# Altium schematic sheet DevKit Board.SchDoc
size B
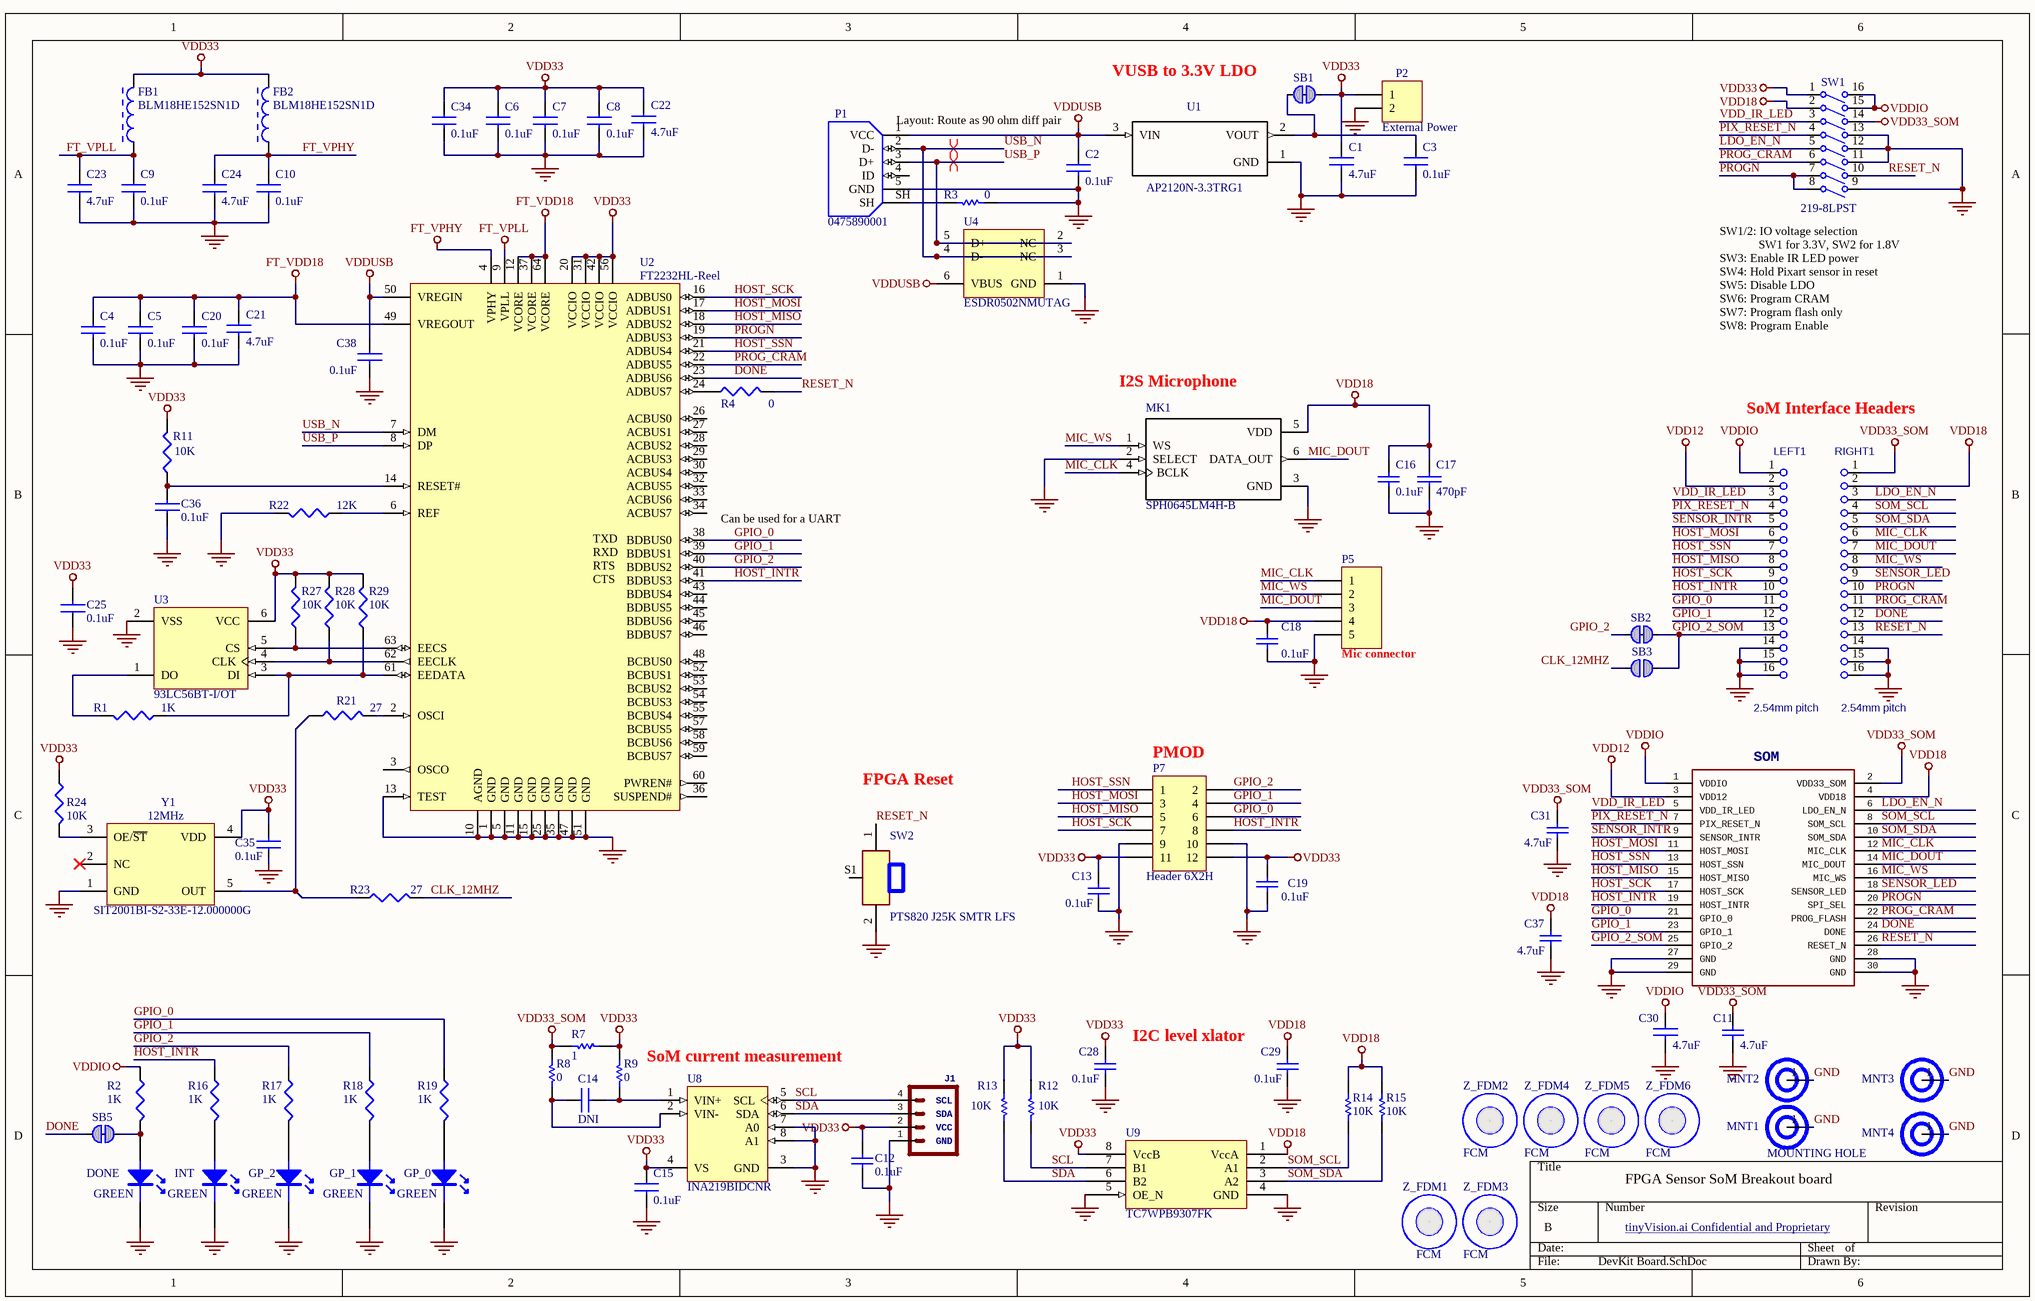
[diagram p0: DevKit Board.SchDoc]

## Parts
C1  4.7uF  [CAPC1005X60N]
C2  0.1uF  [CAPC1005X60N]
C3  0.1uF  [CAPC1005X60N]
C4  0.1uF  [CAPC1005X60N]
C5  0.1uF  [CAPC1005X60N]
C6  0.1uF  [CAPC1005X60N]
C7  0.1uF  [CAPC1005X60N]
C8  0.1uF  [CAPC1005X60N]
C9  0.1uF  [CAPC1005X60N]
C10  0.1uF  [CAPC1005X60N]
C11  4.7uF  [CAPC1005X60N]
C12  0.1uF  [CAPC1005X60N]
C13  0.1uF  [CAPC1005X60N]
C14  DNI  [CAPC1005X60N]
C15  0.1uF  [CAPC1005X60N]
C16  0.1uF  [CAPC1005X60N]
C17  470pF  [CAPC1005X60N]
C18  0.1uF  [CAPC1005X60N]
C19  0.1uF  [CAPC1005X60N]
C20  0.1uF  [CAPC1005X60N]
C21  4.7uF  [CAPC1005X60N]
C22  4.7uF  [CAPC1005X60N]
C23  4.7uF  [CAPC1005X60N]
C24  4.7uF  [CAPC1005X60N]
C25  0.1uF  [CAPC1005X60N]
C28  0.1uF  [CAPC1005X60N]
C29  0.1uF  [CAPC1005X60N]
C30  4.7uF  [CAPC1005X60N]
C31  4.7uF  [CAPC1005X60N]
C34  0.1uF  [CAPC1005X60N]
C35  0.1uF  [CAPC1005X60N]
C36  0.1uF  [CAPC1005X60N]
C37  4.7uF  [CAPC1005X60N]
C38  0.1uF  [CAPC1005X60N]
DONE  GREEN  [LED2012N]
FB1  BLM18HE152SN1D  [MURA-BLM18-RF-H4-CHIP-2_V]
FB2  BLM18HE152SN1D  [MURA-BLM18-RF-H4-CHIP-2_V]
GP_0  GREEN  [LED2012N]
GP_1  GREEN  [LED2012N]
GP_2  GREEN  [LED2012N]
INT  GREEN  [LED2012N]
J1  (no value)  [1X04_1MM_RA]
LEFT1  value 2.54mm pitch  [HDR2x8]  (hidden comment: CONN_GENERIC_16)
MK1  SPH0645LM4H-B  [Knowles_SPH0645LM4H-B_0]
MNT1  MOUNTING HOLE  [MNT620-275N]
MNT2  MOUNTING HOLE  [MNT620-275N]  (value not drawn)
MNT3  MOUNTING HOLE  [MNT620-275N]  (value not drawn)
MNT4  MOUNTING HOLE  [MNT620-275N]  (value not drawn)
P1  0475890001  [*MOLEX_0475890001]
P2  External Power  [HDR1X2]
P5  Mic connector  [HDR1X5]
P7  Header 6X2H  [HDR2X6H]
R1  1K  [RESC1005X40N]
R2  1K  [RESC1005X40N]
R3  0  [RESC1005X40N]
R4  0  [RESC1005X40N]
R7  1  [RESC1005X40N]
R8  0  [RESC1005X40N]
R9  0  [RESC1005X40N]
R11  10K  [RESC1005X40N]
R12  10K  [RESC1005X40N]
R13  10K  [RESC1005X40N]
R14  10K  [RESC1005X40N]
R15  10K  [RESC1005X40N]
R16  1K  [RESC1005X40N]
R17  1K  [RESC1005X40N]
R18  1K  [RESC1005X40N]
R19  1K  [RESC1005X40N]
R21  27  [RESC1005X40N]
R22  12K  [RESC1005X40N]
R23  27  [RESC1005X40N]
R24  10K  [RESC1005X40N]
R27  10K  [RESC1005X40N]
R28  10K  [RESC1005X40N]
R29  10K  [RESC1005X40N]
RIGHT1  value 2.54mm pitch  [HDR2x8]  (hidden comment: CONN_GENERIC_16)
SB1  Solderbridge  [Solderbridge_Shorted]  (value not drawn)  (net tie, no BOM)
SB2  Solderbridge  [Solderbridge_Shorted]  (value not drawn)  (net tie, no BOM)
SB3  Solderbridge  [Solderbridge]  (value not drawn)  (no BOM)
SB5  Solderbridge  [Solderbridge_Shorted]  (value not drawn)  (net tie, no BOM)
SOM  Module  [SOM-SMD]  (value not drawn)
SW1  219-8LPST  [CTS-219-8LPST_V]
SW2  PTS820 J25K SMTR LFS  [PTS820J25MSMTRLFS]
U1  AP2120N-3.3TRG1  [*SOT91P240X110-3N]
U2  FT2232HL-Reel  [LQFP-64]
U3  93LC56BT-I/OT  [SOT-23-OT6_L]
U4  ESDR0502NMUTAG  [ONSC-UDFN-6-517AA-01_V]
U8  INA219BIDCNR  [DCN0008A_M]
U9  TC7WPB9307FK  [SSOP8-P-0.50A]
Y1  12MHz  MPN: SIT2001BI-S2-33E-12.000000G  [SOT23-5]
Z_FDM1  FCM  [FID100X250N]
Z_FDM2  FCM  [FID100X250N]
Z_FDM3  FCM  [FID100X250N]
Z_FDM4  FCM  [FID100X250N]
Z_FDM5  FCM  [FID100X250N]
Z_FDM6  FCM  [FID100X250N]

## Nets
FT_VDD18: C4.1 C5.1 C20.1 C21.1 U2.12(VCORE) U2.37(VCORE) U2.49(VREGOUT) U2.64(VCORE)
FT_VPHY: C10.1 C24.1 FB2.1 U2.4(VPHY)
FT_VPLL: C9.1 C23.1 FB1.1 U2.9(VPLL)
GND: C1.2 C2.2 C3.2 C4.2 C5.2 C6.2 C7.2 C8.2 C9.2 C10.2 C11.2 C12.2 C13.2 C15.2 C16.2 C17.2 C18.2 C19.2 C20.2 C21.2 C22.2 C23.2 C24.2 C25.1 C28.2 C29.2 C30.2 C31.2 C34.2 C35.1 C36.1 C37.2 C38.2 DONE.2 GP_0.2 GP_1.2 GP_2.2 INT.2 J1.1 LEFT1.14 LEFT1.15 LEFT1.16 MK1.2(SELECT) MK1.3(GND) MNT1.1(GND) MNT2.1(GND) MNT3.1(GND) MNT4.1(GND) P1.5(GND) P2.2 P5.5 P7.9 P7.10 R3.1 R22.1 RIGHT1.14 RIGHT1.15 RIGHT1.16 SOM.27(GND) SOM.28(GND) SOM.29(GND) SOM.30(GND) SW1.9(B8) SW1.11(B6) SW1.12(B5) SW1.13(B4) SW2.2 U1.1(GND) U2.1(GND) U2.5(GND) U2.10(AGND) U2.11(GND) U2.13(TEST) U2.15(GND) U2.25(GND) U2.35(GND) U2.47(GND) U2.51(GND) U3.2(VSS) U4.1(GND) U8.3(GND) U8.7(A0) U8.8(A1) U9.4(GND) U9.5(OE_N) Y1.1(GND)
VDD12: LEFT1.2 SOM.3(VDD12)
VDD18: C16.1 C17.1 C18.1 C29.1 C37.1 MK1.5(VDD) P5.4 R14.2 R15.2 RIGHT1.2 SOM.4(VDD18) SW1.2(A2) U9.1(VccA)
VDD33: C1.1 C6.1 C7.1 C8.1 C12.1 C13.1 C15.1 C19.1 C22.1 C25.2 C28.1 C34.1 C35.2 FB1.2 FB2.2 J1.2 P2.1 P7.11 P7.12 R7.1 R9.1 R11.1 R12.2 R13.2 R24.1 R27.1 R28.1 R29.1 SB1.1 SW1.1(A1) U2.20(VCCIO) U2.31(VCCIO) U2.42(VCCIO) U2.56(VCCIO) U3.6(VCC) U8.4(VS) U9.8(VccB) Y1.4(VDD)
VDD33_SOM: C11.1 C31.1 R7.2 R8.1 RIGHT1.1 SOM.2(VDD33_SOM) SW1.14(B3)
VDDIO: C30.1 LEFT1.1 R2.1 SOM.1(VDDIO) SW1.15(B2) SW1.16(B1)
VDDUSB: C2.1 C38.1 P1.1(VCC) U1.3(VIN) U2.50(VREGIN) U4.6(VBUS)
CLK_12MHZ: R23.2 SB3.2
DONE: RIGHT1.12 SB5.2 SOM.24(DONE) U2.23(ADBUS6)
GPIO_0: LEFT1.11 P7.6 R19.1 SOM.21(GPIO_0) U2.38(BDBUS0)
GPIO_1: LEFT1.12 P7.4 R18.1 SOM.23(GPIO_1) U2.39(BDBUS1)
GPIO_2: P7.2 R17.1 SB2.2 U2.40(BDBUS2)
GPIO_2_SOM: LEFT1.13 SB2.1 SB3.1 SOM.25(GPIO_2)
HOST_INTR: LEFT1.10 P7.8 R16.1 SOM.19(HOST_INTR) U2.41(BDBUS3)
HOST_MISO: LEFT1.8 P7.5 SOM.15(HOST_MISO) U2.18(ADBUS2)
HOST_MOSI: LEFT1.6 P7.3 SOM.11(HOST_MOSI) U2.17(ADBUS1)
HOST_SCK: LEFT1.9 P7.7 SOM.17(HOST_SCK) U2.16(ADBUS0)
HOST_SSN: LEFT1.7 P7.1 SOM.13(HOST_SSN) U2.21(ADBUS4)
LDO_EN_N: RIGHT1.3 SOM.6(LDO_EN_N) SW1.5(A5)
MIC_CLK: MK1.4(BCLK) P5.1 RIGHT1.6 SOM.12(MIC_CLK)
MIC_DOUT: MK1.6(DATA_OUT) P5.3 RIGHT1.7 SOM.14(MIC_DOUT)
MIC_WS: MK1.1(WS) P5.2 RIGHT1.8 SOM.16(MIC_WS)
PIX_RESET_N: LEFT1.4 SOM.7(PIX_RESET_N) SW1.4(A4)
PROG_CRAM: RIGHT1.11 SOM.22(PROG_FLASH) SW1.6(A6) U2.22(ADBUS5)
PROGN: RIGHT1.10 SOM.20(SPI_SEL) SW1.7(A7) SW1.8(A8) U2.19(ADBUS3)
RESET_N: R4.2 RIGHT1.13 SOM.26(RESET_N) SW1.10(B7) SW2.1
SCL: J1.4 R12.1 U8.5(SCL) U9.7(B1)
SDA: J1.3 R13.1 U8.6(SDA) U9.6(B2)
SENSOR_INTR: LEFT1.5 SOM.9(SENSOR_INTR)
SENSOR_LED: RIGHT1.9 SOM.18(SENSOR_LED)
SOM_SCL: R14.1 RIGHT1.4 SOM.8(SOM_SCL) U9.2(A1)
SOM_SDA: R15.1 RIGHT1.5 SOM.10(SOM_SDA) U9.3(A2)
USB_N: P1.2(D-) U2.7(DM) U4.3(NC) U4.4(D-)
USB_P: P1.3(D+) U2.8(DP) U4.2(NC) U4.5(D+)
VDD_IR_LED: LEFT1.3 SOM.5(VDD_IR_LED) SW1.3(A3)
NetC3_1: C3.1 SB1.2 U1.2(VOUT)
NetC14_1: C14.1 R8.2 U8.2(VIN-)
NetC14_2: C14.2 R9.2 U8.1(VIN+)
NetC36_2: C36.2 R11.2 U2.14(RESET#)
NetDONE_1: DONE.1 R2.2 SB5.1
NetGP_0_1: GP_0.1 R19.2
NetGP_1_1: GP_1.1 R18.2
NetGP_2_1: GP_2.1 R17.2
NetINT_1: INT.1 R16.2
NetP1_SH: P1.SH R3.2
NetR1_1: R1.1 R29.2 U2.61(EEDATA) U3.3(DI)
NetR1_2: R1.2 U3.1(DO)
NetR4_1: R4.1 U2.24(ADBUS7)
NetR21_1: R21.1 R23.1 Y1.5(OUT)
NetR21_2: R21.2 U2.2(OSCI)
NetR22_2: R22.2 U2.6(REF)
NetR24_2: R24.2 Y1.3(OE/~{ST})
NetR27_2: R27.2 U2.63(EECS) U3.5(CS)
NetR28_2: R28.2 U2.62(EECLK) U3.4(CLK)

Not connected (* = marked no-connect by the designer): P1 4(ID); SW2 S1(GND); U2 3(OSCO) 26(ACBUS0) 27(ACBUS1) 28(ACBUS2) 29(ACBUS3) 30(ACBUS4) 32(ACBUS5) 33(ACBUS6) 34(ACBUS7) 36(SUSPEND#) 43(BDBUS4) 44(BDBUS5) 45(BDBUS6) 46(BDBUS7) 48(BCBUS0) 52(BCBUS1) 53(BCBUS2) 54(BCBUS3) 55(BCBUS4) 57(BCBUS5) 58(BCBUS6) 59(BCBUS7) 60(PWREN#); Y1 2(NC)*; Z_FDM1 1; Z_FDM2 1; Z_FDM3 1; Z_FDM4 1; Z_FDM5 1; Z_FDM6 1

## Layout directives
differential pair: USB_N, USB_P

## Notes on the sheet
- VUSB to 3.3V LDO
- (near P1) Layout: Route as 90 ohm diff pair
- (near SW1) SW1/2: IO voltage selection
  SW1 for 3.3V, SW2 for 1.8V
  SW3: Enable IR LED power
  SW4: Hold Pixart sensor in reset
  SW5: Disable LDO
  SW6: Program CRAM
  SW7: Program flash only
  SW8: Program Enable
- (near MK1) I2S Microphone
- SoM Interface Headers
- (near U2) TXD
- (near U2) RXD
- (near U2) RTS
- (near U2) Can be used for a UART
- (near U2) CTS
- FPGA Reset
- (near P7) PMOD
- I2C level xlator
- SoM current measurement
- FPGA Sensor SoM Breakout board
- tinyVision.ai Confidential and Proprietary

## Library data of the parts
C1 C21-C24 C30 = CAP NP: MPN: C0402C475M7PACTU; Mfg: KEMET; Supplier PN: 399-5499-1-ND
C2-C10 C15 C20 C25 C34-C36 C38 = CAP NP: CAP CER 0.1UF 6.3V 0402; MPN: C0402C104Z4VAC7867; Mfg: KEMET; Supplier PN: 399-1043-1-ND
C11 = Cap_100nF_X7R_10%_0402: CAP CER 4.7UF 6.3V 0402; Part #: E-CAP-003; MPN: C0402C475M7PACTU; Mfg: KEMET; Supplier PN: 399-5499-1-ND; Manufacturer: KEMET; Package: 0402
C12 C13 C16 C18 C19 C28 C29 = Cap_100nF_X7R_10%_0402: CAP CER 0.1UF 6.3V 0402; Manufacturer: TDK; Part #: E-CAP-003; MPN: C0402C104Z4VAC7867; Mfg: KEMET; Supplier PN: 399-1043-1-ND; Package: 0402
C14 = CAP NP: CAP CER 0.1UF 6.3V 0402; MPN: DNP
C17 = CAP: CAP CER 470PF 50V 5% NP0 0402; MPN: GRM1555C1H471JA01D; Mfg: Murata Electronics; Supplier PN: 490-1297-1-ND
C31 C37 = Cap_100nF_X7R_10%_0402: CAP CER 4.7UF 6.3V 0402; Manufacturer: TDK; Part #: E-CAP-003; MPN: C0402C475M7PACTU; Mfg: KEMET; Package: 0402; Supplier PN: 399-5499-1-ND
DONE GP_0-GP_2 INT = LED_1: Avago HSMG-C170; Mfg: Avago Technologies US Inc.; MPN: HSMG-C170; Supplier PN: 516-1434-1-ND
FB1 FB2 = MURA-FB-2: FERRITE BEAD 1.5 KOHM 0603 1LN; Mfg: Murata; ComponentLink1URL: http://www.murata.com/; ComponentLink2URL: http://www.murata.com/products/catalog/pdf/c31e.pdf; ComponentLink3Description: Package Specification; ComponentLink2Description: Datasheet; ComponentLink1Description: Manufacturer URL; ComponentLink3URL: http://www.murata.com/products/catalog/pdf/c31e.pdf; MPN: BLM18HE152SN1D; Supplier PN: 490-5216-1-ND
J1 = QWIIC_CONNECTORJS-1MM: CONN HEADER SMD R/A 4POS 1MM; MPN: SM04B-SRSS-TB(LF)(SN); Mfg: JST Sales America Inc.; SDA: SDA; VCC: VCC; GND: GND; SCL: SCL; Supplier PN: 455-1804-1-ND
MK1 = SPH0645LM4H-B: Mic Mems Digital I2s Omni -26db; Mfg: Knowles; MPN: SPH0645LM4H-B; Supplier PN: 423-1405-1-ND
MNT1-MNT4 = MNT_1: Part #: NA; Notes: PCB; Emcraft #: NA
P1 = 0475890001: CONN RCPT MICRO USB AB 5P SMD RA; Mfg: Molex; MPN: 0475890001; Supplier PN: WM17143CT-ND
P2 = Header 2: Header, 2-Pin; LatestRevisionDate: 17-Jul-2002; LatestRevisionNote: Re-released for DXP Platform.; Publisher: Altium Limited
P5 = Header 5: Header, 5-Pin; MPN: 61300511121; Mfg: Würth Elektronik; Supplier PN: 732-5318-ND
P7 = Header 6X2H: Header, 6-Pin, Dual row, Right Angle; MPN: 67997-212HLF; Mfg: Amphenol ICC (FCI); Supplier PN: 609-3237-ND
R1 = R_SH: RESISTOR 1k OHM 1% 0.0625W 0402; MPN: RC0402FR-071KL; Mfg: Yageo; Supplier PN: 311-1.00KLRCT-ND
R2 R16-R19 = R_SH: RESISTOR 1K OHM 1% 0.0625W 0402; MPN: RC0402FR-071KL; Mfg: Yageo; Supplier PN: 311-1.00KLRCT-ND
R3 R8 R9 = Res_10K_1%_0402: RES 0 OHM 1/16W 5% 0402; MPN: RMCF0402JT10K0; Mfg: STACKPOLE; Supplier PN: RMCF0402JT10K0CT-ND
R4 = R_SH: RESISTOR 0 OHM 1% 0.0625W 0402; MPN: RC0402FR-071KL; Mfg: Yageo; Supplier PN: 311-1.00KLRCT-ND
R7 = Res_10K_1%_0402: RES 1 OHM 1/16W 5% 0402; MPN: RC0402JR-071RL; Mfg: Yageo; Supplier PN: 311-1.0JRCT-ND
R11 R24 R27-R29 = R_SH: RES SMD 10K OHM 1% 1/16W 0402; MPN: RC0402FR-0710KL; Mfg: Yageo; Supplier PN: 311-10.0KLRCT-ND; Price 100: 0.01050
R12-R15 = Res_10K_1%_0402: RES SMD 10K OHM 1% 1/16W 0402; MPN: RC0402FR-0710KL; Mfg: Yageo; Supplier PN: 311-10.0KLRCT-ND
R21 R23 = R_SH: RESISTOR 27 OHM 1% 0.0625W 0402; MPN: RC0402JR-0727RL; Mfg: Yageo; Supplier PN: 311-27JRCT-ND
R22 = R_SH: RESISTOR 12K OHM 1% 0.0625W 0402; MPN: RC0402FR-0712KL; Mfg: Yageo; Supplier PN: 311-12.0KLRCT-ND
SB1 SB2 SB5 = Solderbridge Shorted: Shorted Solderbridge; Artikkelnr Noca: N.A.; Part Number: Solderbridge Shorted; Manufacturer: *; Manufacturer Part Number: *; Datasheet: *; LatestRevisionDate: 2012-08-07; Pin Count: 2; Publisher: Nordic Semiconductor; Published: 2012-08-07; Value: Solderbridge; Note: *; Supplier: *; Supplier part number: *; 2nd source Supplier: *; 2nd source part number: *; Footprint Doc: Solderbridge_Shorted; Artikkelnr Simpro: N.A.
SB3 = Solderbridge: Artikkelnr Noca: N.A.; Part Number: Solderbridge; Manufacturer: *; Manufacturer Part Number: *; Datasheet: *; LatestRevisionDate: 2009-12-14; Pin Count: 2; Publisher: Nordic Semiconductor; Published: 2009-12-14; Value: Solderbridge; Note: *; Supplier: *; Supplier part number: *; 2nd source Supplier: *; 2nd source part number: *; Footprint Doc: Solderbridge; Artikkelnr Simpro: N.A.
SOM = SOM: MPN: DF23C-30DP-0.5V(92); Mfg: Hirose; Supplier PN: H11880CT-ND
SW1 = CTS-219-8LPST-16: Switch, SPST, Surface Mount DIP, 8-way, 16-Pin DIP; Mfg: CTS Electrocomponents; ComponentLink1Description: Manufacturer URL; MPN: 219-8LPST; ComponentLink1URL: http://www.ctscorp.com/; ComponentLink2URL: http://www.ctscorp.com/components/Datasheets/219.pdf; ComponentLink2Description: Datasheet; Supplier PN: CT2198LPST-ND
SW2 = SPST_NO: SWITCH TACTILE SPST-NO 0.05A 12V; Manufacturer: C&K; Supplier Part Number 1: CKN10897CT-ND; Supplier 1: Digi-Key; Manufacturer Part Number: PTS820 J25K SMTR LFS
U1 = AP2120N-3.3TRG1: IC REG LINEAR 3.3V 150MA SOT23; Mfg: Diodes Inc.; Supplier PN: AP2120N-3.3TRG1DICT-ND; MPN: AP2120N-3.3TRG1
U2 = COM-UART-FT2232H-LQFP64: IC USB HS DUAL UART/FIFO 64-LQFP; Mfg: FTDI; ComponentLink1URL: http://www.ftdichip.com/; MPN: FT2232HL-Reel; ComponentLink2Description: Datasheet; Supplier PN: 768-1024-1-ND; ComponentLink1Description: Manufacturer URL; ComponentLink2URL: http://www.ftdichip.com/Support/Documents/DataSheets/ICs/DS_FT2232H.pdf
U3 = MEM-SEEPROM-93AA46B-OT-6: IC EEPROM 2K SPI 2MHZ SOT23-6; Mfg: Microchip Technology; MPN: 93LC56BT-I/OT; Supplier PN: 93LC56BT-I/OTCT-ND
U4 = ONSC-ESDR0502N-UDFN-6-517AA-01: TVS DIODE 5.5V 6UDFN; Mfg: ON Semiconductor; ComponentLink2URL: http://www.onsemi.cn/pub_link/Collateral/ESDR0502N-D.PDF; ComponentLink3URL: http://www.onsemi.com/pub_link/Collateral/517AA.PDF; Supplier PN: ESDR0502NMUTAGOSCT-ND; ComponentLink1Description: Manufacturer URL; ComponentLink2Description: Datasheet; ComponentLink3Description: Package Specification; ComponentLink1URL: http://www.onsemi.com/; MPN: ESDR0502NMUTAG
U8 = TI-INA219DCN8: IC CURRENT MONITOR 1% SOT23-8; MPN: INA219AIDCNR; Mfg: Texas Instruments; ComponentLink3URL: http://www.ti.com/lit/ml/mpds099c/mpds099c.pdf; ComponentLink2URL: http://www.ti.com/general/docs/lit/getliterature.tsp?genericPartNumber=INA219&fileType=pdf; Supplier PN: 296-23770-1-ND; ComponentLink1URL: http://www.ti.com/; ComponentLink1Description: Manufacturer URL; ComponentLink3Description: Package Specification; ComponentLink2Description: Datasheet
U9 = TC7WPB9307FK: Dual bidirectional level translator; MPN: TC7WPB9307FK,LF(CT; Mfg: Toshiba Semiconductor and Storage; Supplier PN: TC7WPB9307FKLF(CTCT-ND
Y1 = SIT2001BI-S2-33E: MEMS OSC XO 12.0000MHZ H/LV-CMOS; Mfg: SiTIME; Supplier PN: 1473-SIT2001BI-S2-33E-12.000000G-ND